# Altium schematic sheet Power_MPU.SchDoc: Power_MPU
size A3; CompanyName: STMicroelectronics; SheetNumber: 4; SheetTotal: 7
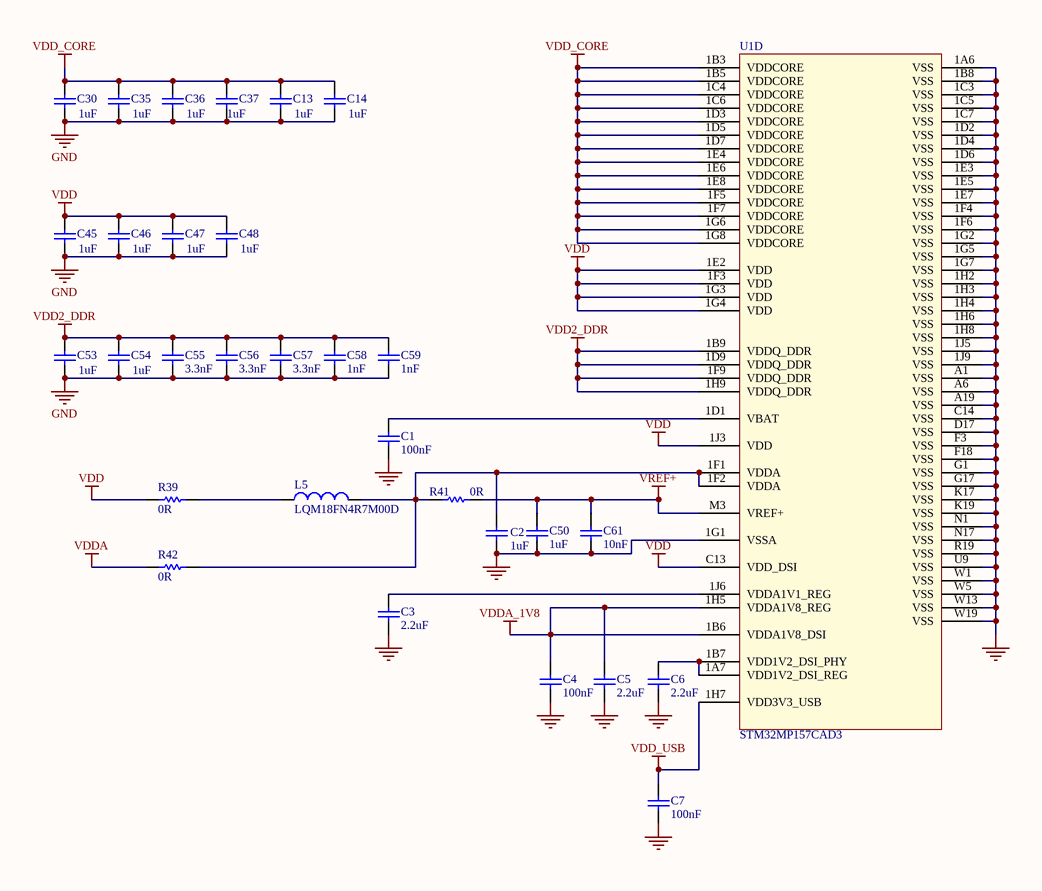
[diagram p0: Power_MPU.SchDoc]

## Parts
C1  value 100nF  [C0402]
C2  value 1uF  [C0402]
C3  value 2.2uF  [C0402]
C4  value 100nF  [C0402]
C5  value 2.2uF  [C0402]
C6  value 2.2uF  [C0402]
C7  value 100nF  [C0402]
C13  value 1uF  [C0402]
C14  value 1uF  [C0402]
C30  value 1uF  [C0402]
C35  value 1uF  [C0402]
C36  value 1uF  [C0402]
C37  value 1uF  [C0402]
C45  value 1uF  [C0402]
C46  value 1uF  [C0402]
C47  value 1uF  [C0402]
C48  value 1uF  [C0402]
C50  value 1uF  [C0402]
C53  value 1uF  [C0402]
C54  value 1uF  [C0402]
C55  value 3.3nF  [C0402]
C56  value 3.3nF  [C0402]
C57  value 3.3nF  [C0402]
C58  value 1nF  [C0402]
C59  value 1nF  [C0402]
C61  value 10nF  [C0402]
L5  value LQM18FN4R7M00D  [L0603_H0P8]
R39  value 0R  [R0402]
R41  value 0R  [R0402]
R42  value 0R  [R0402]
U1  value STM32MP157CAD3  [ICC_TFBGA257_10X10_STM32MP157CAD3_P050-065]  (part D of 5)

## Nets
GND: C1.1 C2.1 C3.1 C4.1 C5.1 C6.1 C7.1 C13.1 C14.1 C30.1 C35.1 C36.1 C37.1 C45.1 C46.1 C47.1 C48.1 C50.1 C53.1 C54.1 C55.1 C56.1 C57.1 C58.1 C59.1 C61.1 U1.1A6(VSS) U1.1B8(VSS) U1.1C3(VSS) U1.1C5(VSS) U1.1C7(VSS) U1.1D2(VSS) U1.1D4(VSS) U1.1D6(VSS) U1.1E3(VSS) U1.1E5(VSS) U1.1E7(VSS) U1.1F4(VSS) U1.1F6(VSS) U1.1G1(VSSA) U1.1G2(VSS) U1.1G5(VSS) U1.1G7(VSS) U1.1H2(VSS) U1.1H3(VSS) U1.1H4(VSS) U1.1H6(VSS) U1.1H8(VSS) U1.1J5(VSS) U1.1J9(VSS) U1.A1(VSS) U1.A6(VSS) U1.A19(VSS) U1.C14(VSS) U1.D17(VSS) U1.F3(VSS) U1.F18(VSS) U1.G1(VSS) U1.G17(VSS) U1.K17(VSS) U1.K19(VSS) U1.N1(VSS) U1.N17(VSS) U1.R19(VSS) U1.U9(VSS) U1.W1(VSS) U1.W5(VSS) U1.W13(VSS) U1.W19(VSS)
VDD: C45.2 C46.2 C47.2 C48.2 R39.1 U1.1E2(VDD) U1.1F3(VDD) U1.1G3(VDD) U1.1G4(VDD) U1.1J3(VDD) U1.C13(VDD_DSI)
VDD2_DDR: C53.2 C54.2 C55.2 C56.2 C57.2 C58.2 C59.2 U1.1B9(VDDQ_DDR) U1.1D9(VDDQ_DDR) U1.1F9(VDDQ_DDR) U1.1H9(VDDQ_DDR)
VDD_CORE: C13.2 C14.2 C30.2 C35.2 C36.2 C37.2 U1.1B3(VDDCORE) U1.1B5(VDDCORE) U1.1C4(VDDCORE) U1.1C6(VDDCORE) U1.1D3(VDDCORE) U1.1D5(VDDCORE) U1.1D7(VDDCORE) U1.1E4(VDDCORE) U1.1E6(VDDCORE) U1.1E8(VDDCORE) U1.1F5(VDDCORE) U1.1F7(VDDCORE) U1.1G6(VDDCORE) U1.1G8(VDDCORE)
VDD_USB: C7.2 U1.1H7(VDD3V3_USB)
VDDA: R42.1
VDDA_1V8: C4.2 C5.2 U1.1B6(VDDA1V8_DSI) U1.1H5(VDDA1V8_REG)
VREF+: C50.2 C61.2 R41.2 U1.M3(VREF+)
NetC1_2: C1.2 U1.1D1(VBAT)
NetC2_2: C2.2 L5.2 R41.1 R42.2 U1.1F1(VDDA) U1.1F2(VDDA)
NetC3_2: C3.2 U1.1J6(VDDA1V1_REG)
NetC6_2: C6.2 U1.1A7(VDD1V2_DSI_REG) U1.1B7(VDD1V2_DSI_PHY)
NetL5_1: L5.1 R39.2

## Notes on the sheet
- Title:
- Project:
- Size:
- Revision:
- Variant:
- A3
- -
- Date:
- Reference:
- Sheet:
- of

## Library data of the parts
C1 C4 C7 = MCD-00006: Capacitor, MLCC, 100nF, 16V, X7R, 10%, 0402, T=0.5mm; Manufacturer_Part_Number: CC0402KRX7R7BB104; Manufacturer: YAGEO; Alternate_Manufacturer_Part_Number: GCM155R71C104KA55D; Alternate_Manufacturer: MURATA; ECCN_US: EAR99; ECCN_EU: NEC; Provided_By: SUBCO; Internal_Part_Number: MCD-00006; ComponentLink1Description: Datasheet; Status: Released; Part_Type: Capacitor; Package: C0402; ComponentLink1URL: http://tunmcdsvn.tun.st.com/Component_Datasheet_Library/Trunk/Capacitors/Yageo_Multilayer_Capacitor_X7R_series_100pF_to_22uF
C2 C13 C14 C30 C35-C37 C45-C48 C50 C53 C54 = MCD-00095: Capacitor, MLCC, 1uF, 25V, X5R, 10%, 0402, T=0,5mm; Manufacturer_Part_Number: GRM155R61E105KA12; Manufacturer: MURATA; Alternate_Manufacturer_Part_Number: GRM155R60J105KE19; ECCN_US: EAR99; ECCN_EU: NEC; Provided_By: SUBCO; Internal_Part_Number: MCD-00095; Status: Released; Part_Type: Capacitor; Package: C0402; ComponentLink1Description: Datasheet; ComponentLink1URL: http://tunmcdsvn.tun.st.com/Component_Datasheet_Library/Trunk/Capacitors/Murata_Capacitor_GR_series; Alternate_Manufacturer: MURATA
C3 C5 C6 = MCD-01823: Capacitor,MLCC,2.2uF,6V3,X5R,10%,0402,T=0.5; Manufacturer_Part_Number: GRM155R60J225KE95D; Manufacturer: MURATA; ECCN_US: EAR99; ECCN_EU: NEC; Provided_By: SUBCO; Internal_Part_Number: MCD-01823; Status: Checked; Part_Type: Capacitor; Package: C0402; ComponentLink1Description: Datasheet; ComponentLink1URL: http://tunmcdsvn.tun.st.com/Component_Datasheet_Library/Trunk/Capacitors/Murata_Capacitor_GR_series
C55-C57 = MCD-01462: Capacitor, MLCC, 3.3nF, 16V, X7R, 10%, 0402, T=0.5mm; Manufacturer_Part_Number: CC0402KRX7R7BB332; Manufacturer: YAGEO; Provided_By: SUBCO; Internal_Part_Number: MCD-01462; Status: Footprint available; Part_Type: Capacitor; Package: C0402; ComponentLink1Description: Datasheet; ComponentLink1URL: http://tunmcdsvn.tun.st.com/Component_Datasheet_Library/Trunk/Capacitors/Yageo_Multilayer_Capacitor_X7R_series_100pF_to_22uF/Yageo_Mutilayer_Capacitor_X7R_100pF_to_22uF.pdf; ECCN_US: N/A; ECCN_EU: N/A
C58 C59 = MCD-00198: Capacitor, MLCC, 1nF, 16V, X7R, 10%, 0402, T=0.5mm; Manufacturer_Part_Number: CC0402KRX7R7BB102; Manufacturer: YAGEO; Provided_By: SUBCO; ECCN_US: EAR99; ECCN_EU: NEC; Internal_Part_Number: MCD-00198; Status: Released; Part_Type: Capacitor; Package: C0402; ComponentLink1Description: Datasheet; ComponentLink1URL: http://tunmcdsvn.tun.st.com/Component_Datasheet_Library/Trunk/Capacitors/Yageo_Multilayer_Capacitor_X7R_series_100pF_to_22uF
C61 = MCD-00011: Capacitor, MLCC, 10nF, 16V, X7R, 10%, 0402, T=0.5mm; Manufacturer_Part_Number: CC0402KRX7R7BB103; Manufacturer: YAGEO; ECCN_US: EAR99; ECCN_EU: NEC; Provided_By: SUBCO; Internal_Part_Number: MCD-00011; Status: Released; Part_Type: Capacitor; Package: C0402; ComponentLink1Description: Datasheet; ComponentLink1URL: http://tunmcdsvn.tun.st.com/Component_Datasheet_Library/Trunk/Capacitors/Yageo_Multilayer_Capacitor_X7R_series_100pF_to_22uF
L5 = MCD-01134: IND 4.7uH 20% 80mA 600mhom 0603; Part_Type: Inductor; Manufacturer: MURATA; Provided_By: SUBCO; Internal_Part_Number: MCD-01134; Status: Footprint available; Manufacturer_Part_Number: LQM18FN4R7M00D; Package: 0603; ComponentLink1Description: Datasheet; ComponentLink1URL: http://tunmcdsvn.tun.st.com/Component_Datasheet_Library/Trunk/Inductors/Murata_inductor_LQM18FN4R7M00D; ECCN_US: n/a; ECCN_EU: n/a
R39 R42 = MCD-00052: Resistor,0R,0402,5%,1/16W; Manufacturer_Part_Number: RC0402JR-070RL; Manufacturer: YAGEO; Provided_By: SUBCO; ECCN_US: EAR99; ECCN_EU: NEC; Internal_Part_Number: MCD-00052; Status: Released; Part_Type: Resistor; Package: R0402; ComponentLink1Description: Datasheet; ComponentLink1URL: http://tunmcdsvn.tun.st.com/Component_Datasheet_Library/Trunk/Resistors/Yageo_Resistor_RC0402-series
R41 = MCD-00052: Resistor,0R,0402,5%,1/16W; Manufacturer_Part_Number: RC0402JR-070RL; Manufacturer: YAGEO; ECCN_US: EAR99; ECCN_EU: NEC; Provided_By: SUBCO; Internal_Part_Number: MCD-00052; Status: Released; Part_Type: Resistor; ComponentLink1Description: Datasheet; ComponentLink1URL: http://tunmcdsvn.tun.st.com/Component_Datasheet_Library/Trunk/Resistors/Yageo_Resistor_RC0402-series; Package: R0402
U1 = MCD-01144: MPU TFBGA10x10 secure boot+crypto; Part_Type: IC; Manufacturer: STMICROELECTRONICS; Provided_By: SUBCO with ST control; ECCN_US: 5A002A4; Internal_Part_Number: MCD-01144; Status: Footprint available; Manufacturer_Part_Number: STM32MP157CAD3; ComponentLink1Description: Datasheet; ComponentLink1URL: http://TBD; ECCN_EU: 5A002A4